# Altium schematic sheet Cover.SchDoc
size Letter; DocumentNumber: 1; SheetNumber: 1; SheetTotal: 3
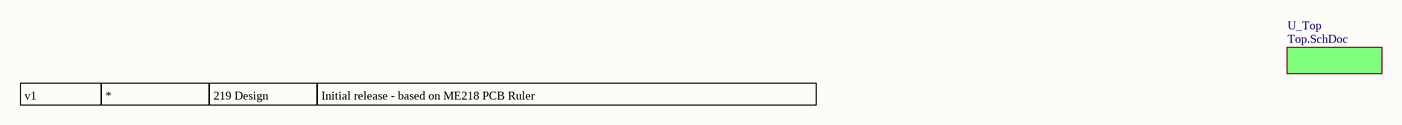
[diagram p0: Cover.SchDoc]

## Sub-sheets
U_Top = Top.SchDoc: no entries

## Notes on the sheet
- v1
- 219 Design
- Initial release - based on ME218 PCB Ruler
- Revision History
- VERSION
- DATE
- AUTHOR
- DESCRIPTION
- Project
- Sheet Name
- Drawn By
- Part No
- Sheet
- of
- Revision
- Date: